# Altium schematic sheet M7_DSP_Codec.SchDoc
size A3; SheetNumber: 5; SheetTotal: 5
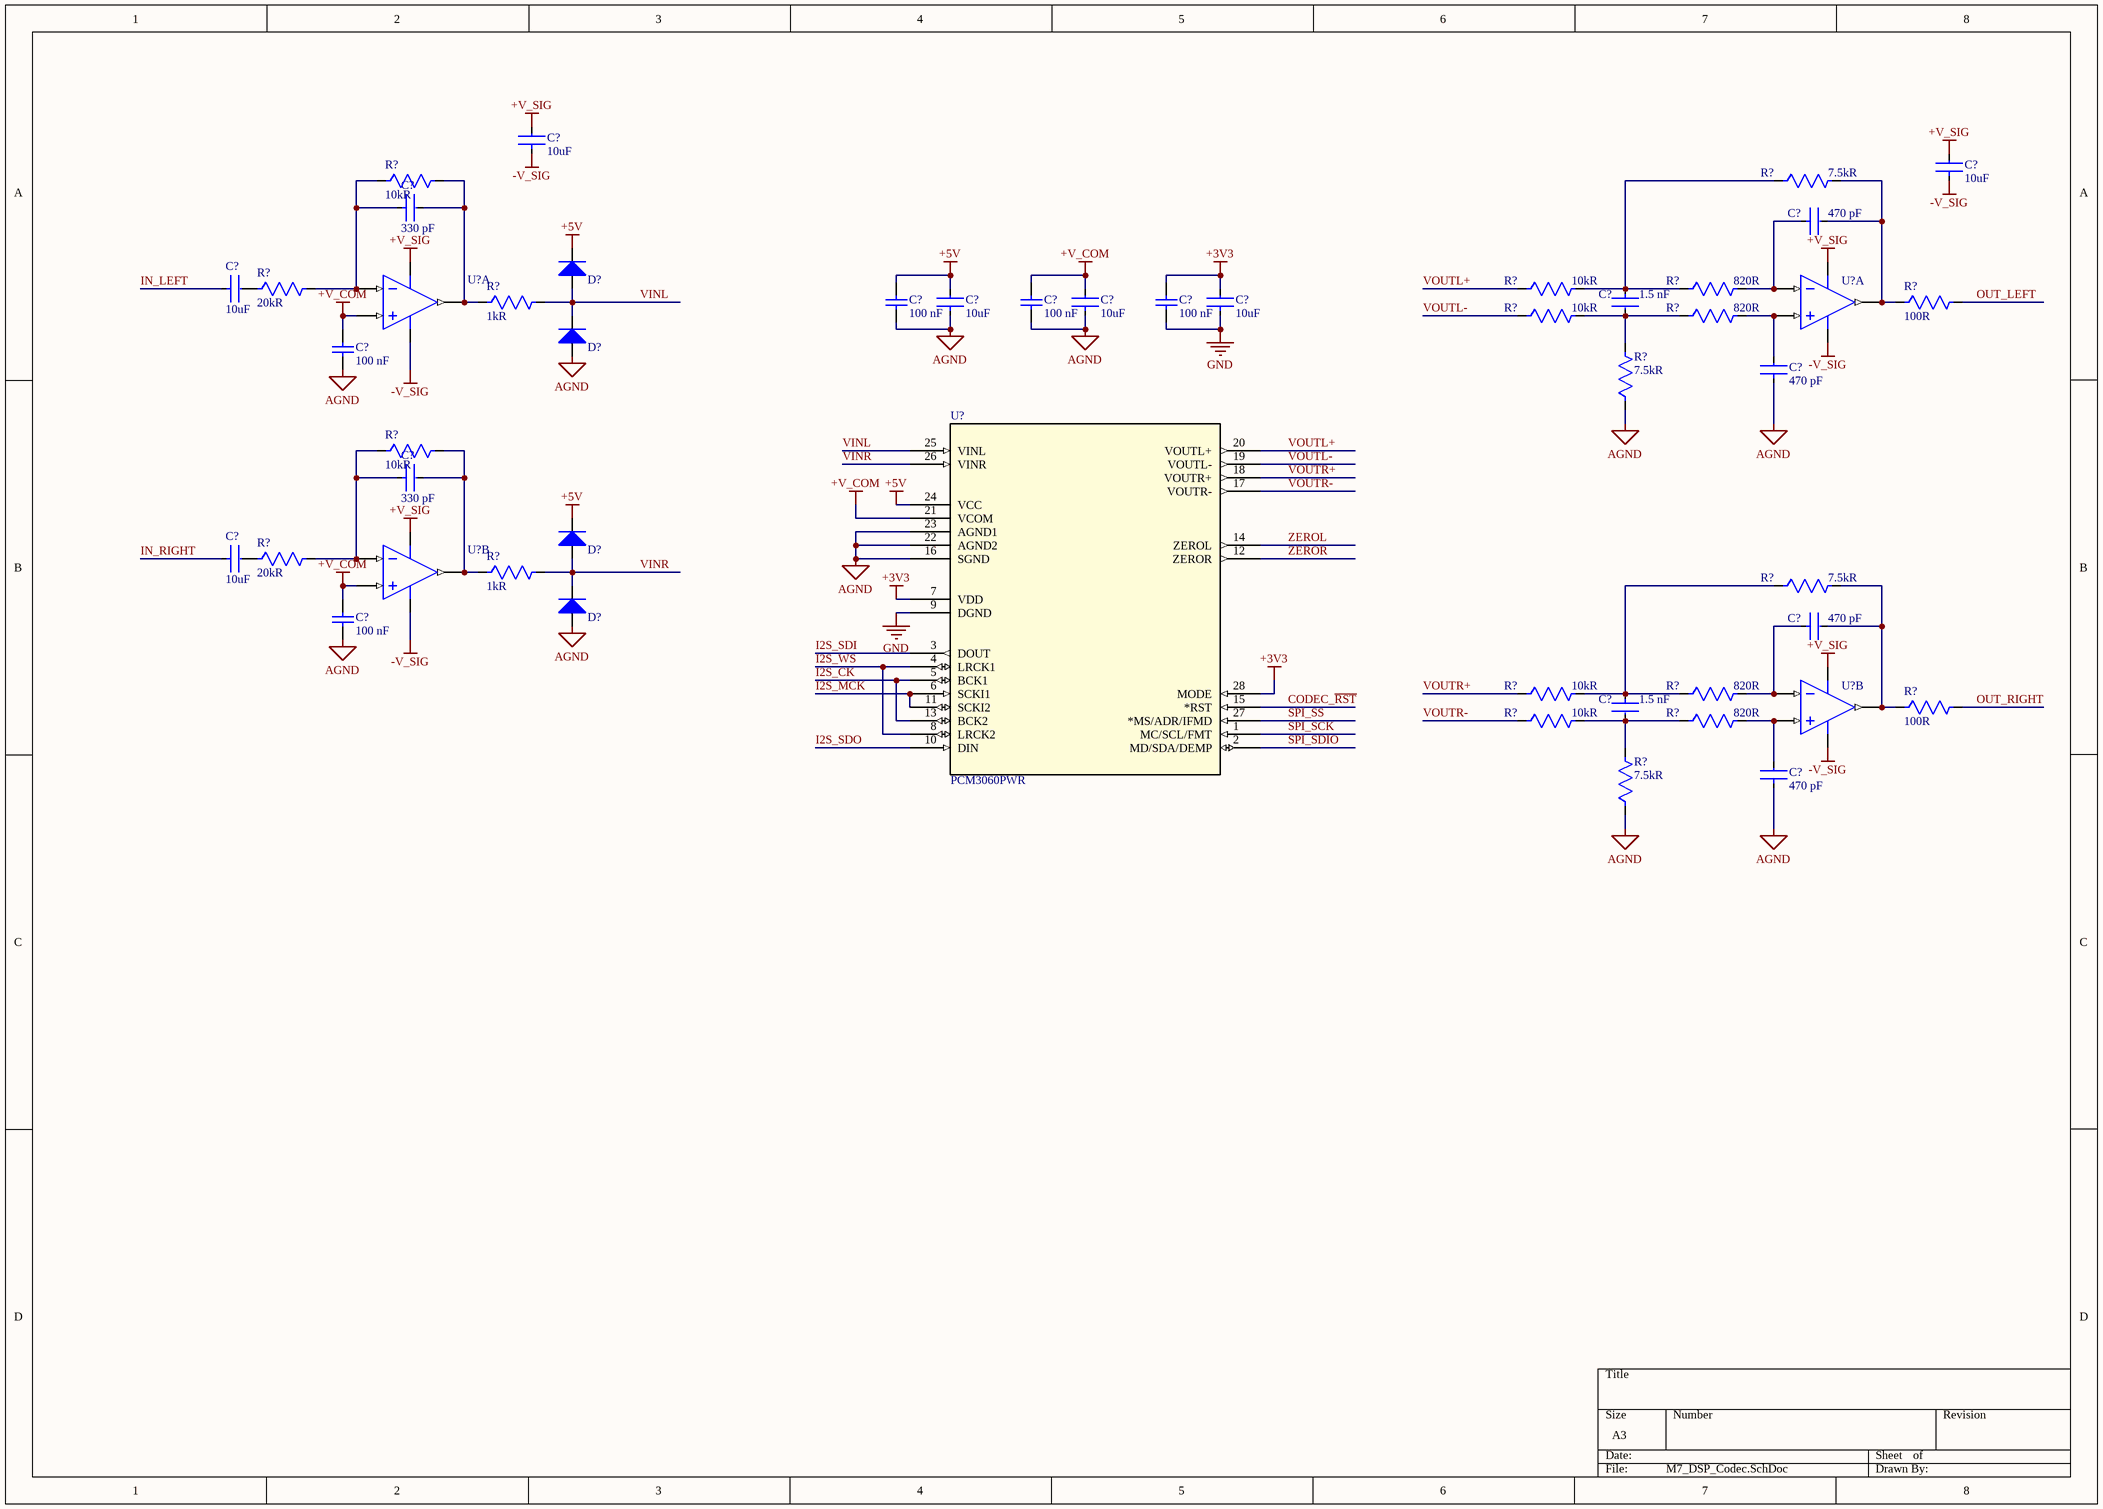
[diagram p0: M7_DSP_Codec.SchDoc]

## Parts
(Parts that share a designator on the sheet are numbered #1, #2 ... from top to bottom, then left to right.)
C?#1  Capacitance: 10uF  [FP-0603-L_1_6_0_2-W_0_8_0-MFG]  (hidden comment: TMK107BBJ106MA-T)
C?#2  Capacitance: 10uF  [FP-0603-L_1_6_0_2-W_0_8_0-MFG]  (hidden comment: TMK107BBJ106MA-T)
C?#3  value 330 pF  [FP-C0603C-CF-IPC_B]  (hidden comment: C0603C331F5GACTU)
C?#4  Capacitance: 470 pF  [FP-C0603C-CF-IPC_B]  (hidden comment: C0603C471F5GACTU)
C?#5  Capacitance: 100 nF  [CAPC1608X90X40ML10T20]  (hidden comment: CC0603ZRY5V9BB104)
C?#6  Capacitance: 100 nF  [CAPC1608X90X40ML10T20]  (hidden comment: CC0603ZRY5V9BB104)
C?#7  Capacitance: 100 nF  [CAPC1608X90X40ML10T20]  (hidden comment: CC0603ZRY5V9BB104)
C?#8  value 10uF  [FP-GRM21B-0_2-e0_2_0_7-MFG]  (hidden comment: GRM21BC71E106ME11L)
C?#9  Capacitance: 1.5 nF  [FP-C0603C-CF-IPC_B]  (hidden comment: C0603C152F5GACTU)
C?#10  Capacitance: 10uF  [FP-0603-L_1_6_0_2-W_0_8_0-MFG]  (hidden comment: TMK107BBJ106MA-T)
C?#11  Capacitance: 10uF  [FP-0603-L_1_6_0_2-W_0_8_0-MFG]  (hidden comment: TMK107BBJ106MA-T)
C?#12  Capacitance: 10uF  [FP-0603-L_1_6_0_2-W_0_8_0-MFG]  (hidden comment: TMK107BBJ106MA-T)
C?#13  Capacitance: 100 nF  [CAPC1608X90X40ML10T20]  (hidden comment: CC0603ZRY5V9BB104)
C?#14  Capacitance: 470 pF  [FP-C0603C-CF-IPC_B]  (hidden comment: C0603C471F5GACTU)
C?#15  value 330 pF  [FP-C0603C-CF-IPC_B]  (hidden comment: C0603C331F5GACTU)
C?#16  value 10uF  [FP-GRM21B-0_2-e0_2_0_7-MFG]  (hidden comment: GRM21BC71E106ME11L)
C?#17  Capacitance: 100 nF  [CAPC1608X90X40ML10T20]  (hidden comment: CC0603ZRY5V9BB104)
C?#18  Capacitance: 470 pF  [FP-C0603C-CF-IPC_B]  (hidden comment: C0603C471F5GACTU)
C?#19  Capacitance: 1.5 nF  [FP-C0603C-CF-IPC_B]  (hidden comment: C0603C152F5GACTU)
C?#20  Capacitance: 470 pF  [FP-C0603C-CF-IPC_B]  (hidden comment: C0603C471F5GACTU)
D?#1  1N4148WT  [FAIR-SOD-523F-2_V]  (value not drawn)
D?#2  1N4148WT  [FAIR-SOD-523F-2_V]  (value not drawn)
D?#3  1N4148WT  [FAIR-SOD-523F-2_V]  (value not drawn)
D?#4  1N4148WT  [FAIR-SOD-523F-2_V]  (value not drawn)
R?#1  Resistance: 10kR  [FP-AC0603-MFG]  (hidden comment: AC0603FR-0710KL)
R?#2  Resistance: 7.5kR  [FP-AC0603-IPC_C]  (hidden comment: AC0603FR-077K5L)
R?#3  Resistance: 20kR  [FP-AC0603-IPC_C]  (hidden comment: AC0603FR-0720KL)
R?#4  Resistance: 10kR  [FP-AC0603-MFG]  (hidden comment: AC0603FR-0710KL)
R?#5  Resistance: 820R  [FP-AC0603-IPC_C]  (hidden comment: AC0603FR-07820RL)
R?#6  Resistance: 1kR  [FP-AC0603-IPC_C]  (hidden comment: AC0603FR-071KL)
R?#7  Resistance: 100R  [FP-AC0603-MFG]  (hidden comment: AC0603FR-07100RL)
R?#8  Resistance: 10kR  [FP-AC0603-MFG]  (hidden comment: AC0603FR-0710KL)
R?#9  Resistance: 820R  [FP-AC0603-IPC_C]  (hidden comment: AC0603FR-07820RL)
R?#10  Resistance: 7.5kR  [FP-AC0603-IPC_C]  (hidden comment: AC0603FR-077K5L)
R?#11  Resistance: 10kR  [FP-AC0603-MFG]  (hidden comment: AC0603FR-0710KL)
R?#12  Resistance: 20kR  [FP-AC0603-IPC_C]  (hidden comment: AC0603FR-0720KL)
R?#13  Resistance: 1kR  [FP-AC0603-IPC_C]  (hidden comment: AC0603FR-071KL)
R?#14  Resistance: 7.5kR  [FP-AC0603-IPC_C]  (hidden comment: AC0603FR-077K5L)
R?#15  Resistance: 10kR  [FP-AC0603-MFG]  (hidden comment: AC0603FR-0710KL)
R?#16  Resistance: 820R  [FP-AC0603-IPC_C]  (hidden comment: AC0603FR-07820RL)
R?#17  Resistance: 100R  [FP-AC0603-MFG]  (hidden comment: AC0603FR-07100RL)
R?#18  Resistance: 10kR  [FP-AC0603-MFG]  (hidden comment: AC0603FR-0710KL)
R?#19  Resistance: 820R  [FP-AC0603-IPC_C]  (hidden comment: AC0603FR-07820RL)
R?#20  Resistance: 7.5kR  [FP-AC0603-IPC_C]  (hidden comment: AC0603FR-077K5L)
U?#1  TL072HIDR  [D0008A_N]  (value not drawn)  (part A of 2)
U?#2  TL072HIDR  [D0008A_N]  (value not drawn)  (part A of 2)
U?#3  TL072HIDR  [D0008A_N]  (value not drawn)  (part B of 2)
U?#4  TL072HIDR  [D0008A_N]  (value not drawn)  (part B of 2)
U?#5  PCM3060PWR  [PW28]

## Nets
+3V3: C?#7.1 C?#12.2 U?#5.7(VDD) U?#5.28(MODE)
+5V: C?#5.1 C?#10.2 D?#1.1(K) D?#3.1(K) U?#5.24(VCC)
+V_COM: C?#6.1 C?#11.2 C?#13.1 C?#17.1 U?#1.3(IN1+) U?#3.5(IN2+) U?#5.21(VCOM)
+V_SIG: C?#1.2 C?#2.2 U?#1.8(VCC+) U?#2.8(VCC+) U?#3.8(VCC+) U?#4.8(VCC+)
-V_SIG: C?#1.1 C?#2.1 U?#1.4(VCC-) U?#2.4(VCC-) U?#3.4(VCC-) U?#4.4(VCC-)
AGND: C?#5.2 C?#6.2 C?#10.1 C?#11.1 C?#13.2 C?#14.1 C?#17.2 C?#20.1 D?#2.2(A) D?#4.2(A) R?#10.1 R?#20.1 U?#5.16(SGND) U?#5.22(AGND2) U?#5.23(AGND1)
GND: C?#7.2 C?#12.1 U?#5.9(DGND)
CODEC_~{RST}: U?#5.15(*RST)
I2S_CK: U?#5.5(BCK1) U?#5.13(BCK2)
I2S_MCK: U?#5.6(SCKI1) U?#5.11(SCKI2)
I2S_SDI: U?#5.3(DOUT)
I2S_SDO: U?#5.10(DIN)
I2S_WS: U?#5.4(LRCK1) U?#5.8(LRCK2)
IN_LEFT: C?#8.1
IN_RIGHT: C?#16.1
OUT_LEFT: R?#7.2
OUT_RIGHT: R?#17.2
SPI_~{SS}: U?#5.27(*MS/ADR/IFMD)
SPI_SCK: U?#5.1(MC/SCL/FMT)
SPI_SDIO: U?#5.2(MD/SDA/DEMP)
VINL: D?#1.2(A) D?#2.1(K) R?#6.2 U?#5.25(VINL)
VINR: D?#3.2(A) D?#4.1(K) R?#13.2 U?#5.26(VINR)
VOUTL+: R?#4.1 U?#5.20(VOUTL+)
VOUTL-: R?#8.1 U?#5.19(VOUTL-)
VOUTR+: R?#15.1 U?#5.18(VOUTR+)
VOUTR-: R?#18.1 U?#5.17(VOUTR-)
ZEROL: U?#5.14(ZEROL)
ZEROR: U?#5.12(ZEROR)
NetC?#3_1: C?#3.1 R?#1.1 R?#3.2 U?#1.2(IN1-)
NetC?#3_2: C?#3.2 R?#1.2 R?#6.1 U?#1.1(OUT1)
NetC?#4_1: C?#4.1 R?#5.2 U?#2.2(IN1-)
NetC?#4_2: C?#4.2 R?#2.2 R?#7.1 U?#2.1(OUT1)
NetC?#8_2: C?#8.2 R?#3.1
NetC?#9_1: C?#9.1 R?#2.1 R?#4.2 R?#5.1
NetC?#9_2: C?#9.2 R?#8.2 R?#9.1 R?#10.2
NetC?#14_2: C?#14.2 R?#9.2 U?#2.3(IN1+)
NetC?#15_1: C?#15.1 R?#11.1 R?#12.2 U?#3.6(IN2-)
NetC?#15_2: C?#15.2 R?#11.2 R?#13.1 U?#3.7(OUT2)
NetC?#16_2: C?#16.2 R?#12.1
NetC?#18_1: C?#18.1 R?#16.2 U?#4.6(IN2-)
NetC?#18_2: C?#18.2 R?#14.2 R?#17.1 U?#4.7(OUT2)
NetC?#19_1: C?#19.1 R?#14.1 R?#15.2 R?#16.1
NetC?#19_2: C?#19.2 R?#18.2 R?#19.1 R?#20.2
NetC?#20_2: C?#20.2 R?#19.2 U?#4.5(IN2+)

## Library data of the parts
C?#1 C?#2 C?#10-C?#12 = CMP-14477-005164-2: Multilayer Ceramic Capacitor 10uF 25V X5R 20% SMD 0603 T/R; Packaging: Tape and Reel; Tolerance: 20%; Mount: Surface Mount; Case Code (Metric): 1608; Case Code (Imperial): 0603; Min Operating Temperature: -55°C; Lead Free: Lead Free; RoHS Compliant: Yes; Case/Package: 0603; Max Operating Temperature: 85°C; Voltage Rating: 25V; Supplier 1: Rs; Supplier Part Number 1: 1782887
C?#3 C?#15 = CMP-1035-01569-3: CAP CER 330PF 50V 1% NP0 0603; Manufacturer: KEMET; Temperature Coefficient: 30ppm/°C; Temperature Characteristic: C0G; Material: Ceramic; Tolerance: 0.01; Automotive Grade: Grade 1; Voltage Rating: 50 V; Temperature: -55°C to +125°C; Temperature Range High: +125°C; ComponentLink2Description: Datasheet; Automotive: Yes; Octopart: https://octopart.com/c0603c331f5gactu-kemet-9142706; Temperature Range Low: -55°C; ComponentLink2URL: https://api.kemet.com/component-edge/download/datasheet/C0603C100J5GACAUTO.pdf; Device Class L1: Passive Components; Mouser Description: Multilayer Ceramic Capacitors MLCC - SMD/SMT 50volts 330pF C0G 1%; Capacitance: 330 pF; Device Class L3: Ceramic Capacitors; Manufacturer Part Number: C0603C331F5GACTU; Height: 0.87mm; RoHS: TRUE; Device Class L2: Capacitors; Package: C0603C-CF; Digikey Description: CAP CER 330PF 50V 1% NP0 0603; Category: Cap; Lead Free: Yes; Supplier 1: Mouser; Supplier Part Number 1: 80-C0603C331F5G
C?#4 C?#14 C?#18 C?#20 = CMP-2006-03206-2: CAP CER 470PF 50V 1% NP0 0603; Manufacturer: KEMET; Temperature Coefficient: 30ppm/°C; Tolerance: 0.01; Temperature Characteristic: C0G; Automotive Grade: Grade 1; Material: Ceramic; Temperature Range Low: -55°C; ComponentLink2Description: Datasheet; Digikey Description: CAP CER 470PF 50V 1% NP0 0603; Manufacturer Part Number: C0603C471F5GACTU; Device Class L1: Passive Components; Category: Cap; ComponentLink2URL: https://api.kemet.com/component-edge/download/datasheet/C0603C100J5GACAUTO.pdf; Automotive: Yes; Package: C0603C-CF; Value: 470 pF; Octopart: https://octopart.com/c0603c471f5gactu-kemet-9143748; Device Class L3: Ceramic Capacitors; Device Class L2: Capacitors; Temperature Range High: +125°C; RoHS: TRUE; Lead Free: Yes; Height: 0.87mm; Voltage Rating: 50 V; Temperature: -55°C to +125°C; Mouser Description: Cap Ceramic 470pF 50V C0G 1% SMD 0603 125°C Paper T/R; Supplier 1: Mouser; Supplier Part Number 1: 80-C0603C471F5G
C?#5-C?#7 C?#13 C?#17 = CMP-1035-02594-2: Chip Capacitor, 100 nF, - 20% to + 80%, 50 V, -30 to 85 degC, 0603 (1608 Metric), RoHS, Tape and Reel; Manufacturer: Yageo; Tolerance: -20%,+80%; Product Training Modules: MultilayerCeramicCapacitors; Temperature Coefficient: Y5V(F); Kits: CC060300000000000-ND-MLCC0603SAMPLEKIT; Other Names: 311-1343-1; Featured Product: CommodityMultilayerCeramicCapacitors–CCSeries; Online Catalog: CCSeries; Voltage - Rated: 50V; Mounting Type: SurfaceMount,MLCC; Package Description: 2-Pin Surface Mount Device, Body 1.6 x 0.8 mm; Ratings: -; Lead Spacing: -; Standard Package: 1; Applications: GeneralPurpose; Size / Dimension: 0.063"Lx0.031"W(1.60mmx0.80mm); Package Reference: 0603; Operating Temperature: -30°C~85°C; Features: -; Height - Seated (Max): -; Thickness (Max): 0.035"(0.90mm); Series: CC; Datasheet URL: https://datasheet.ciiva.com/17434/upy-gphc-y5v-6-3v-to-50v-5-17434523.pdf; Family: CeramicCapacitors; Mounting Technology: SurfaceMount; Packaging: CutTape(CT); Package / Case: 0603(1608Metric); Manufacturer URL: http://www.yageo.com/; Category: Capacitors; Lead Style: -; Datasheet Version: Rev. 5, 07/2010; Supplier 1: Rs; Supplier Part Number 1: 6169565
C?#8 C?#16 = GRM21BC71E106ME11L: Multilayer Ceramic Capacitors MLCC - SMD/SMT 0805 10uF 25volts *Derate Voltage/Temp; Manufacturer: Murata; Voltage Rating: 25V; Tolerance: 20%; Dielectric: X7S; Manufacturer Part Number: GRM21BC71E106ME11L; RoHS: Yes; Category: Ceramic Capacitors; Stock 1: 6000; Pricing 1: 3000=0.1097, 9000=0.0994, 24000=0.097, 45000=0.0923 (USD); Mounting Technology: Surface Mount; Case/Package: 0805; Case Code (Metric): 2012; Case Code (Imperial): 0805; Weight: 0.000335oz; Min Operating Temperature: -55°C; Max Operating Temperature: 125°C; Packaging: Tape and Reel; Termination: SMD/SMT; Voltage Rating (DC): 25V; Package Quantity: 3000; Series: GRM; Length: 0.079inch; Width: 0.049inch; Height: 1.25mm; Thickness: 0.057inch; RoHS Compliant: Yes; ComponentLink1URL: http://www.mouser.com/ds/2/281/c02e-2905.pdf?src-supplier=Mouser; ComponentLink1Description: http://www.mouser.com/ds/2/281/c02e-2905.pdf?src-supplier=Mouser; ComponentLink2URL: http://search.murata.co.jp/Ceramy/image/img/A01X/G101/ENG/GRM21BC71E106ME11-01.pdf?src-supplier=Digikey; ComponentLink2Description: http://search.murata.co.jp/Ceramy/image/img/A01X/G101/ENG/GRM21BC71E106ME11-01.pdf?src-supplier=Digikey; ComponentLink3URL: http://search.murata.co.jp/Ceramy/image/img/A01X/partnumbering_e_01.pdf?src-supplier=Digikey; ComponentLink3Description: http://search.murata.co.jp/Ceramy/image/img/A01X/partnumbering_e_01.pdf?src-supplier=Digikey; ComponentLink4URL: https://datasheet.octopart.com/GRM21BC71E106ME11L-Murata-datasheet-149523451.pdf?src-supplier=Newark; ComponentLink4Description: https://datasheet.octopart.com/GRM21BC71E106ME11L-Murata-datasheet-149523451.pdf?src-supplier=Newark; ComponentLink5URL: https://datasheet.octopart.com/GRM21BC71E106ME11L-Murata-datasheet-32479577.pdf?src-supplier=Future+Electronics; ComponentLink5Description: https://datasheet.octopart.com/GRM21BC71E106ME11L-Murata-datasheet-32479577.pdf?src-supplier=Future+Electronics; Supplier Part Number 1: GRM21BC71E106ME11L; Supplier 1: Arrow Electronics
C?#9 C?#19 = CMP-1035-01960-3: Cap Ceramic 0.0015uF 50V C0G 1% SMD 0603 125°C Punched Paper T/R; Manufacturer: KEMET; Automotive Grade: Grade 1; Temperature Coefficient: 30ppm/°C; Tolerance: 0.01; Value: 1.5 nF; ComponentLink2Description: Datasheet; Lead Free: Yes; Digikey Description: Cap Ceramic 0.0015uF 50V C0G 1% SMD 0603 125°C Punched Paper T/R; Temperature: -55°C to +125°C; Voltage Rating: 50 V; Category: Cap; Device Class L2: Capacitors; Temperature Range Low: -55°C; Temperature Characteristic: C0G; Package: C0603C-CF; Manufacturer Part Number: C0603C152F5GACTU; Octopart: https://octopart.com/c0603c152f5gactu-kemet-10304761; ComponentLink2URL: https://api.kemet.com/component-edge/download/datasheet/C0603C100J5GACAUTO.pdf; Material: Ceramic; Automotive: Yes; RoHS: TRUE; Device Class L1: Passive Components; Device Class L3: Ceramic Capacitors; Mouser Description: Cap Ceramic 0.0015uF 50V C0G 1% SMD 0603 125°C Punched Paper T/R; Height: 0.87mm; Temperature Range High: +125°C; Supplier 1: Mouser; Supplier Part Number 1: 80-C0603C152F5G
D?#1-D?#4 = CMP-0881-00001-1: High Conductance Fast Switching Diode, 75 V, -55 to 150 degC, 2-Pin SOD523F, RoHS; Manufacturer: Fairchild Semiconductor; IR (VR: 75 V)=5 uA Max.; VF: 1 V Max.; BVR (IR: 5 uA)=75 V Min.; CO: 4 pF Max.; DatasheetVersion: Rev. A2; ComponentLink1Description: Manufacturer URL; PackageDescription: 2-Pin Surface Mount Device, Body 1.2 x 0.8 mm, Height 0.7 mm; ComponentLink2URL: http://www.fairchildsemi.com/ds/1N/1N4148WT.pdf; ComponentLink2Description: Datasheet; PartNumber: 1N4148WT; ComponentLink1URL: http://www.fairchildsemi.com/; Temperature Range: -55 to 150 degC; Mounting Technology: Surface Mount; PackageReference: SOD-523F-2; RoHS: TRUE; Supplier 1: Future Electronics; Supplier Part Number 1: 4906632
R?#1 R?#4 R?#8 R?#11 R?#15 R?#18 = CMP-2000-04818-3: RES 10KΩ 1.00% 0.1W 0603; Power Rating: 100mW; Tolerance: 1%; Voltage Rating: 50V; Temperature Coefficient: 100ppm/°C; Ratings: AEC-Q200; Case Code (Metric): 1608; Max Power Dissipation: 100mW; Height: 0.45mm; Package Quantity: 1; Max Operating Temperature: 155°C; Resistor Type: Thick Film; Depth: 0.8mm; RoHS Compliant: Yes; Min Operating Temperature: -55°C; Packaging: Tape and Reel; Number of Terminations: 2; Length: 1.6mm; Features: Moisture Resistant; Military Standard: Not; Case Code (Imperial): 0603; Size Code: 0603; Termination: SMD/SMT; Case/Package: 0603; Mount: Surface Mount; Width: 0.8mm; Lead Free: Lead Free; Series: AC; Construction: Rectangular; Supplier 1: Future Electronics; Supplier Part Number 1: 2029400
R?#2 R?#10 R?#14 R?#20 = CMP-03412-008671-2: RES 7.5KΩ 1.00% 0.1W 0603; Voltage Rating: 50V; Tolerance: 1%; Max Power Dissipation: 100mW; Temperature Coefficient: 100ppm/°C; Case Code (Imperial): 0603; RoHS Compliant: Yes; Height: 0.45mm; Resistor Type: Thick Film; Number of Terminations: 2; Termination: SMD/SMT; Packaging: Tape and Reel; Length: 1.6mm; Width: 0.8mm; Min Operating Temperature: -55°C; Lead Free: Lead Free; Case/Package: 0603; Features: Moisture Resistant; Ratings: AEC-Q200; Power Rating: 100mW; Max Operating Temperature: 155°C; Case Code (Metric): 1608; Series: AC; Supplier 1: Future Electronics; Supplier Part Number 1: 7029296
R?#3 R?#12 = CMP-2000-04831-3: RES 20KΩ 1.00% 0.1W 0603; Power Rating: 100mW; Temperature Coefficient: 100ppm/°C; Tolerance: 1%; Voltage Rating: 50V; Width: 0.8mm; Case Code (Metric): 1608; Max Operating Temperature: 155°C; Ratings: AEC-Q200; Min Operating Temperature: -55°C; Number of Terminations: 2; RoHS Compliant: Yes; Resistor Type: Thick Film; Height: 0.45mm; Lead Free: Lead Free; Max Power Dissipation: 100mW; Case Code (Imperial): 0603; Case/Package: 0603; Length: 1.6mm; Features: Moisture Resistant; Series: AC; Termination: SMD/SMT; Packaging: Tape and Reel; Supplier 1: Future Electronics; Supplier Part Number 1: 5026404
R?#5 R?#9 R?#16 R?#19 = CMP-2000-04854-3: RES 820Ω 1.00% 0.1W 0603; Temperature Coefficient: 100ppm/°C; Working Voltage: 75V; Tolerance: 1%; Voltage Rating: 50V; Max Power Dissipation: 100mW; Case/Package: 0603; Resistor Type: Thick Film; Ratings: AEC-Q200; Length: 1.6mm; Mount: Surface Mount; Width: 0.8mm; Height: 0.45mm; Case Code (Metric): 1608; RoHS Compliant: Yes; Technology: THICK FILM; Packaging: Tape and Reel; Lead Free: Lead Free; Max Operating Temperature: 155°C; Features: Moisture Resistant; Number of Terminations: 2; Series: AC; Case Code (Imperial): 0603; Moisture Sensitivity Level: 1; Min Operating Temperature: -55°C; Power Rating: 100mW; Termination: SMD/SMT; Supplier 1: Future Electronics; Supplier Part Number 1: 8029296
R?#6 R?#13 = CMP-2000-04828-3: RES 1kΩ 1.00% 0.1W 0603; Voltage Rating: 50V; Power Rating: 100mW; Tolerance: 1%; Temperature Coefficient: 100ppm/°C; Depth: 0.8mm; Case/Package: 0603; Size Code: 0603; Case Code (Metric): 1608; Height: 0.022inch; Series: AC; Width: 0.031inch; Construction: Rectangular; Length: 0.063inch; Case Code (Imperial): 0603; Package Quantity: 1; RoHS Compliant: Yes; Features: Moisture Resistant; Resistor Type: Thick Film; Max Power Dissipation: 100mW; Packaging: Tape and Reel; Termination: SMD/SMT; Ratings: AEC-Q200; Max Operating Temperature: 155°C; Min Operating Temperature: -55°C; Military Standard: Not; Lead Free: Lead Free; Number of Terminations: 2; Supplier 1: Future Electronics; Supplier Part Number 1: 1029290
R?#7 R?#17 = CMP-2000-04817-3: RES 100Ω 1.00% 0.1W 0603; Temperature Coefficient: 100ppm/°C; Voltage Rating: 50V; Max Power Dissipation: 100mW; Tolerance: 1%; Series: AC; Height: 0.45mm; Max Operating Temperature: 155°C; Depth: 0.8mm; Lead Free: Lead Free; Packaging: Tape and Reel; Min Operating Temperature: -55°C; Number of Terminations: 2; Length: 1.6mm; RoHS Compliant: Yes; Contact Plating: Tin; Construction: Rectangular; Radiation Hardening: No; Width: 0.8mm; Power Rating: 100mW; Ratings: AEC-Q200; Termination: SMD/SMT; Resistor Type: Thick Film; Weight: 7.1E-05oz; Case Code (Metric): 1608; Military Standard: Not; Case Code (Imperial): 0603; Size Code: 0603; Features: Moisture Resistant; Case/Package: 0603; Supplier 1: Future Electronics; Supplier Part Number 1: 2026405
U?#1-U?#4 = TL072HIDR: Dual-channel low input bias current standard op amp 8-SOIC -40 to 125; Manufacturer: Texas Instruments; Supplier 1: Mouser; Manufacturer Part Number: TL072HIDR; RoHS: No; Category: Amplifiers - Op Amps, Buffer, Instrumentation; Stock 1: 665; Pricing 1: 1=0.37, 10=0.299, 50=0.299, 100=0.204, 1000=0.125, 10000=0.106 (USD); Supplier Part Number 1: 595-TL072HIDR
U?#5 = PCM3060PWR: 24-bit Asynchronous Stereo Audio Codec with 96/192kHz sampling rate 28-TSSOP -25 to 85; Mfr_Name: Texas Instruments; Interface: Serial,I2C,SPI,2-Wire,3-WIRE; Min Supply Voltage: 4.5V; Operating Supply Voltage: 5V; Max Supply Voltage: 5.5V; Resolution: 24b; Number of A/D Converters: 1; Sampling Rate: 192KS/s; Signal to Noise Ratio (SNR): 99dB; Power Consumption: 160mW; Number of ADC Channels: 2; Copyright: Copyright (C) 2024 Ultra Librarian. All rights reserved.; Manufacturer_Part_Number: PCM3060PWR; RefDes: RefDes; Type: DEV; Supplier 1: Mouser; Manufacturer: Texas Instruments; Manufacturer Part Number: PCM3060PWR; RoHS: Yes; Category: Amplifiers - Audio; Stock 1: 9554; Pricing 1: 1=4.7, 10=4.19, 50=4.19, 100=3.85, 1000=3.08, 10000=2.92 (USD); Case/Package: TSSOP; Pins: 28; Weight: 0.004145oz; Min Operating Temperature: -25°C; Max Operating Temperature: 85°C; Packaging: Tape and Reel; Package Quantity: 2000; Number of D/A Converters: 1; Number of Analog Inputs: 2; Number of DAC Channels: 2; Number of Analog Outputs: 2; Series: -; Radiation Hardening: No; Lead Free: Lead Free; RoHS Compliant: Yes; ComponentLink1URL: https://datasheet.ciiva.com/1693/pcm3060-1693338.pdf?src-supplier=Digikey; ComponentLink1Description: https://datasheet.ciiva.com/1693/pcm3060-1693338.pdf?src-supplier=Digikey; ComponentLink2URL: https://datasheet.ciiva.com/3027/pcm3060-3027369.pdf?src-supplier=Avnet; ComponentLink2Description: https://datasheet.ciiva.com/3027/pcm3060-3027369.pdf?src-supplier=Avnet; Supplier Part Number 1: 595-PCM3060PWR